# Altium schematic sheet Repeat_MOSFET_IRLML0030.SchDoc: Repeat Low Power MOSFET
size A4; Author: Milomir Spajić; Organization: Memristor-Robotics; Address1: Vladimira Perića Valtera; Address2: Novi Sad, 21000; Address3: Serbia; SheetNumber: 11; SheetTotal: 13
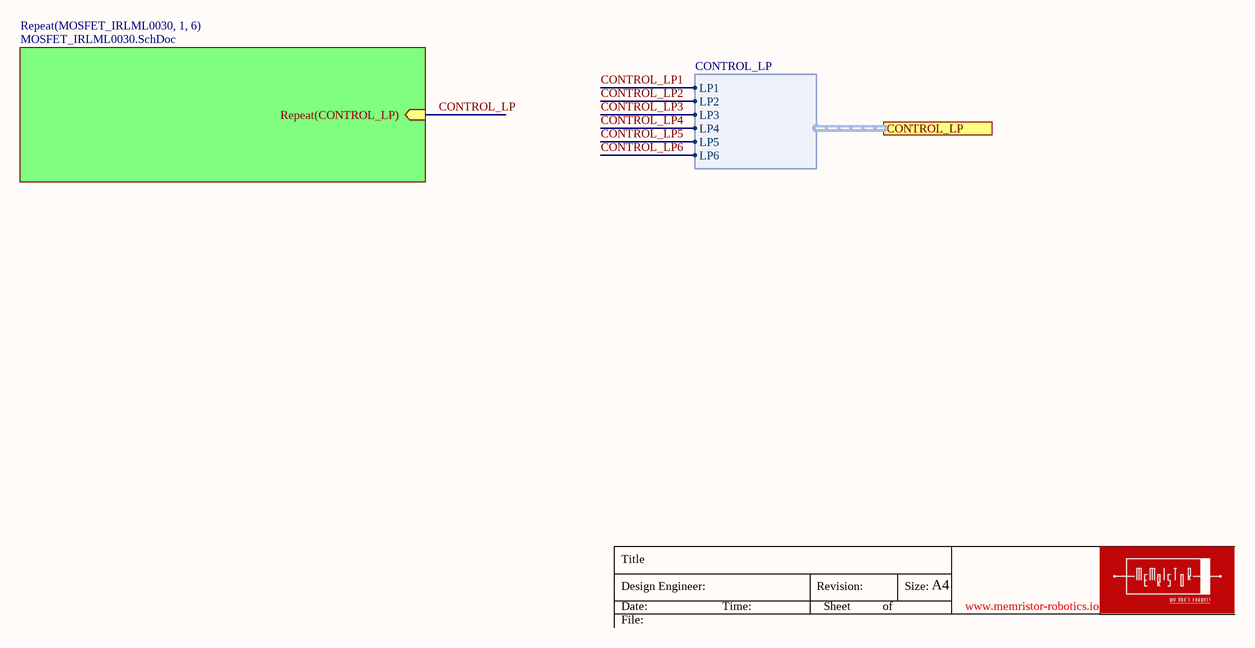
[diagram p0: Repeat_MOSFET_IRLML0030.SchDoc]

## Sub-sheets
Repeat(MOSFET_IRLML0030, 1, 6) = MOSFET_IRLML0030.SchDoc: Repeat(CONTROL_LP) (in)

## Ports
CONTROL_LP (harness CONTROL_LP)

## Harnesses
CONTROL_LP: LP1, LP2, LP3, LP4, LP5, LP6

## Nets
CONTROL_LP: sheet Repeat(MOSFET_IRLML0030, 1, 6)/Repeat(CONTROL_LP)
CONTROL_LP1: port CONTROL_LP.LP1
CONTROL_LP2: port CONTROL_LP.LP2
CONTROL_LP3: port CONTROL_LP.LP3
CONTROL_LP4: port CONTROL_LP.LP4
CONTROL_LP5: port CONTROL_LP.LP5
CONTROL_LP6: port CONTROL_LP.LP6

## Notes on the sheet
- Title
- Date:
- Design Engineer:
- Time:
- Revision:
- Sheet
- of
- Size:
- A4
- www.memristor-robotics.io
- File: